# EAGLE design booster004 (EAGLE 4.16)
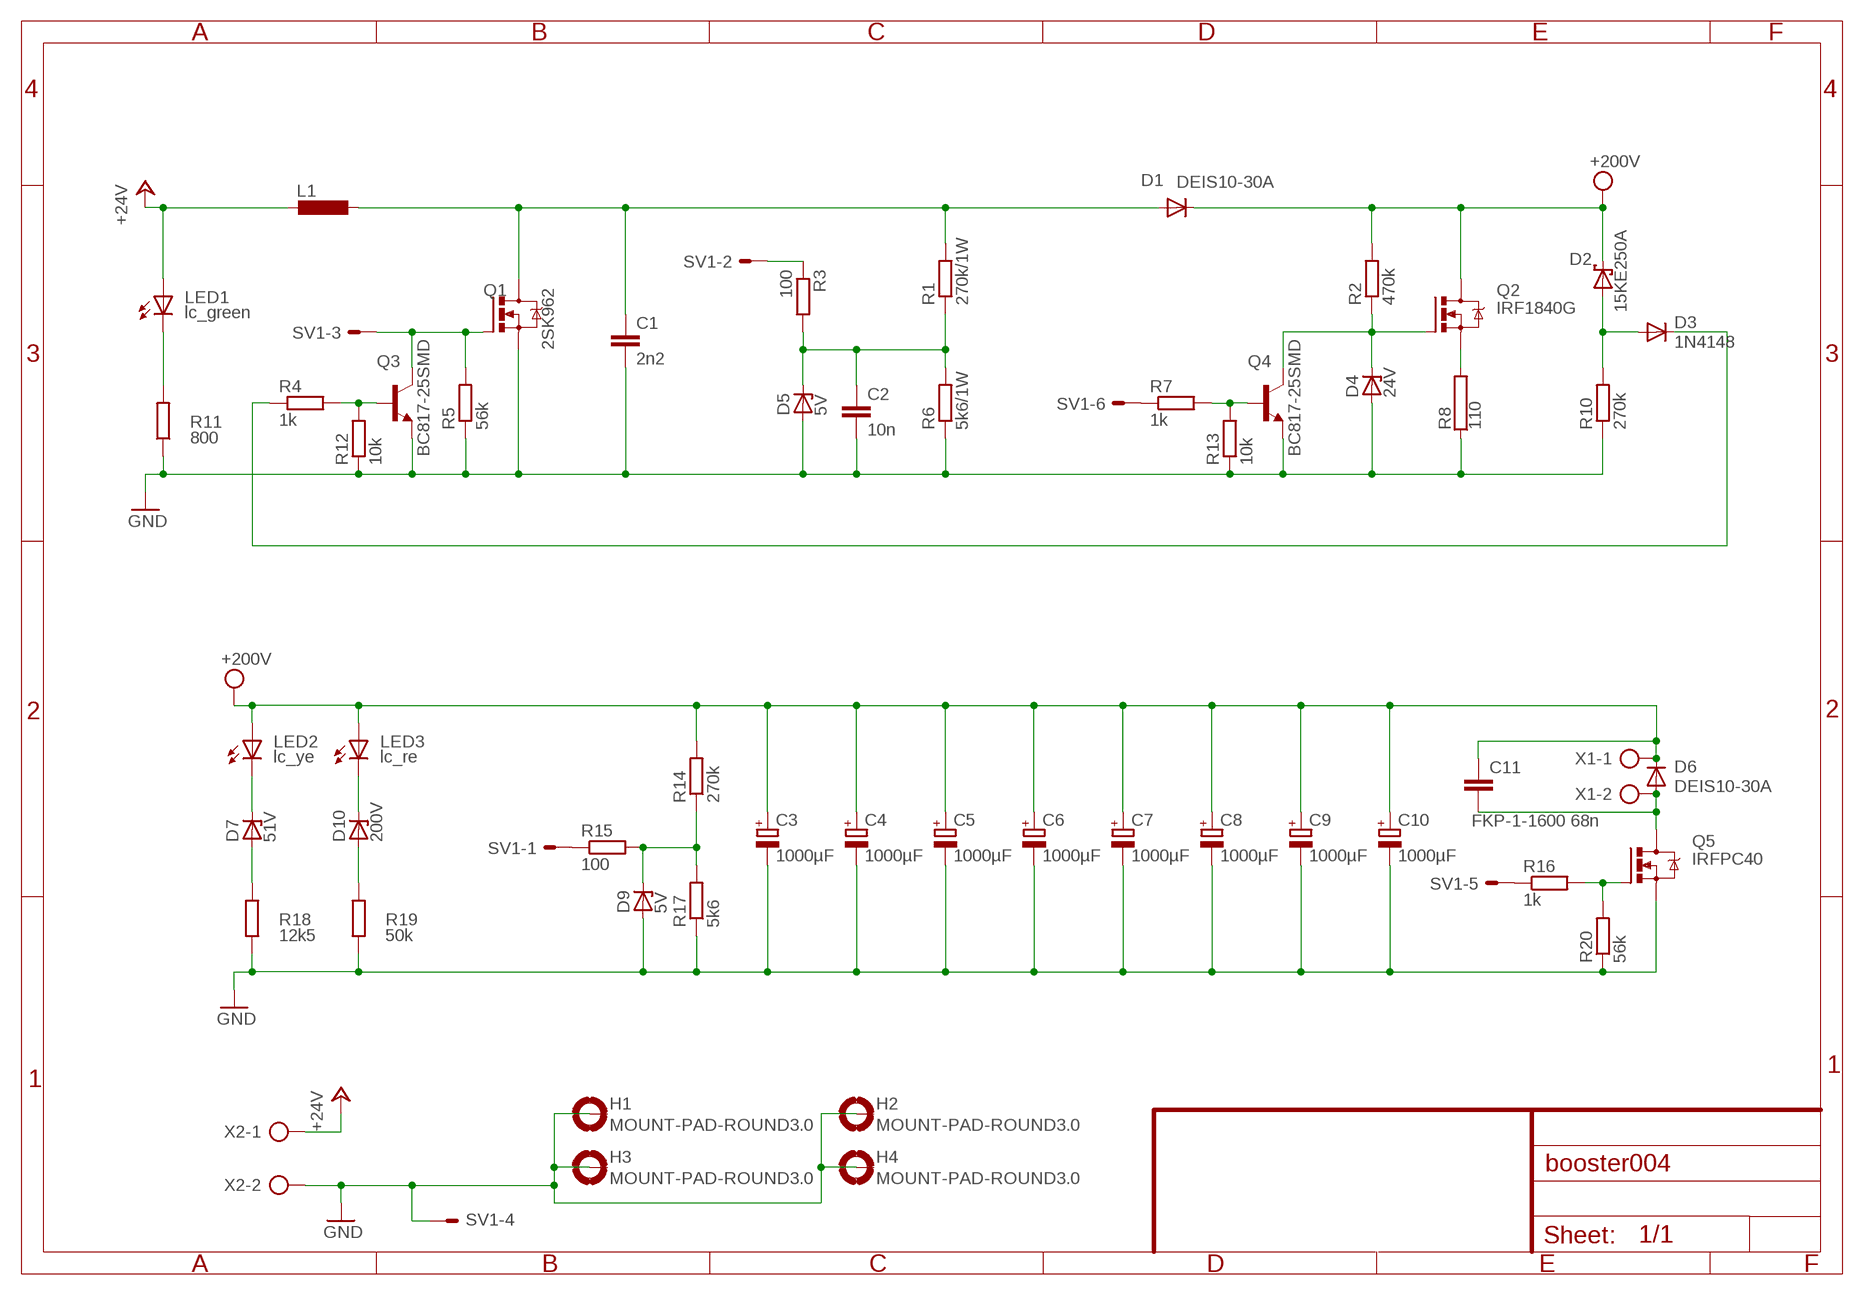
[diagram p0: schematic, sheet 1]

## Parts
C1  2n2  C-EU150-054X183  [C150-054X183]
C2  10n  C-EUC0603  [C0603]
C3  1000µF  CPOL-EUE10-35  [EB35D]
C4  1000µF  CPOL-EUE10-35  [EB35D]
C5  1000µF  CPOL-EUE10-35  [EB35D]
C6  1000µF  CPOL-EUE10-35  [EB35D]
C7  1000µF  CPOL-EUE10-35  [EB35D]
C8  1000µF  CPOL-EUE10-35  [EB35D]
C9  1000µF  CPOL-EUE10-35  [EB35D]
C10  1000µF  CPOL-EUE10-35  [EB35D]
C11  FKP-1-1600 68n  C-EU375-192X418  [C375-192X418]
D1  DEIS10-30A  [TO247AD]
D2  15KE250A  15KEXX  [CB429-17]
D3  1N4148  [DO35-10]
D4  24V  ZENER-DIODESOT23  [SOT23]
D5  5V  ZENER-DIODESOT23  [SOT23]
D6  DEIS10-30A  [TO247AD]
D7  51V  ZENER-DIODEDO35Z10  [DO35Z10]
D9  5V  ZENER-DIODESOT23  [SOT23]
D10  200V  ZENER-DIODEF126-12  [F126Z12]
H1  MOUNT-PAD-ROUND3.0  [3,0-PAD]
H2  MOUNT-PAD-ROUND3.0  [3,0-PAD]
H3  MOUNT-PAD-ROUND3.0  [3,0-PAD]
H4  MOUNT-PAD-ROUND3.0  [3,0-PAD]
L1  L-EUTJ6-U1  [TJ6-U1]
LED1  lc_green  LED5MM  [LED5MM]
LED2  lc_ye  LED5MM  [LED5MM]
LED3  lc_re  LED5MM  [LED5MM]
Q1  2SK962  IRFPC40  [TO247BV]
Q2  IRF1840G  IRF740  [TO220BV]
Q3  BC817-25SMD  [SOT23-BEC]
Q4  BC817-25SMD  [SOT23-BEC]
Q5  IRFPC40  [TO247BV]
R1  270k/1W  R-EU_0207/10  [0207/10]
R2  470k  R-EU_R0805  [R0805]
R3  100  R-EU_R0805  [R0805]
R4  1k  R-EU_R0805  [R0805]
R5  56k  R-EU_R0805  [R0805]
R6  5k6/1W  R-EU_0207/10  [0207/10]
R7  1k  R-EU_R0805  [R0805]
R8  110  RHS25  [HS25]
R10  270k  R-EU_R0805  [R0805]
R11  800  R-EU_R0805  [R0805]
R12  10k  R-EU_R0805  [R0805]
R13  10k  R-EU_R0805  [R0805]
R14  270k  R-EU_R0805  [R0805]
R15  100  R-EU_R0805  [R0805]
R16  1k  R-EU_R0805  [R0805]
R17  5k6  R-EU_R0805  [R0805]
R18  12k5  R-EU_R0805  [R0805]
R19  50k  R-EU_R0805  [R0805]
R20  56k  R-EU_R0805  [R0805]
SV1  ML6LE  [ML6L]
X1  AK500/2-H  [AK500/2-H]
X2  AK500/2-H  [AK500/2-H]

## Nets
+24V: L1.2 LED1.A X2.1
ADC_250V: C2.1 D5.3(C) R1.1 R3.2 R6.2
ADC_250V1: D9.3(C) R14.1 R15.2 R17.2
GND [Power]: C1.2 C2.2 C3.- C4.- C5.- C6.- C7.- C8.- C9.- C10.- D4.1(A) D5.1(A) D9.1(A) H1.B3,0(MOUNT) H2.B3,0(MOUNT) H3.B3,0(MOUNT) H4.B3,0(MOUNT) Q1.S Q3.E Q4.E Q5.S R5.1 R6.1 R8.1 R10.1 R11.1 R12.1 R13.1 R17.1 R18.1 R19.1 R20.1 SV1.4 X2.2
N$1: D2.A D3.A R10.2
N$2: Q5.G R16.2 R20.2
N$3: D7.A R18.2
N$4: D3.C R4.1
N$5 [Power]: C11.2 D6.A Q5.D X1.2
N$6: D7.C LED2.K(C)
N$7: LED1.K(C) R11.2
N$8: R15.1 SV1.1
N$9: R3.1 SV1.2
N$12: D10.A R19.2
N$13: D10.C LED3.K(C)
N$18: D4.3(C) Q2.G Q4.C R2.1
N$19: Q2.S R8.2
N$21: Q4.B R7.2 R13.2
N$22: R16.1 SV1.5
N$23: Q3.B R4.2 R12.2
N$24: R7.1 SV1.6
N$29: Q1.G Q3.C R5.2 SV1.3
N$32 [Power]: C1.1 D1.A L1.1 Q1.D R1.2
VPP: C3.+ C4.+ C5.+ C6.+ C7.+ C8.+ C9.+ C10.+ C11.1 D1.K(C) D2.C D6.K(C) LED2.A LED3.A Q2.D R2.2 R14.2 X1.1 ; supply symbol labelled +200V

## Library data of the parts
C1 C2 C11 = rcl:C-EU: CAPACITOR, European symbol
C3-C10 = rcl:CPOL-EU: POLARIZED CAPACITOR, European symbol
D1 D6 = carpenoctem:DEIS10-30A
D2 = diode:15KEXX: DIODE
D3 = diode:1N4148: DIODE high speed (Philips)
D4 D5 D7 D9 D10 = diode:ZENER-DIODE: Z-Diode
H1-H4 = holes:MOUNT-PAD-ROUND: MOUNTING PAD, round
L1 = rcl:L-EU: INDUCTOR, European symbol
LED1-LED3 = led:LED: LED OSRAM: - CHIPLED LG R971, LG N971, LY N971, LG Q971, LY Q971, LO R971, LY R971 LH N974, LH R974 LS Q976, LO Q976, LY Q976 LO Q996 - Hyper CHIPLED LW Q18S LB Q993, LB Q99A, LB R99A - SideLED LS A670, LO A670, LY A670, LG A670, LP A670 LB A673, LV A673, LT A673, LW A673 LH A674 LY A675 LS A676, LA A676, LO A676, LY A676, LW A676 LS A679, LY A679, LG A679 - Hyper Micro SIDELED® LS Y876, LA Y876, LO Y876, LY Y876 LT Y87S - SmartLED LW L88C, LW L88S LB L89C, LB L89S, LG L890 LS L89K, LO L89K, LY L89K LS L896, LA L896, LO L896, LY L896 - TOPLED LS T670, LO T670, LY T670, LG T670, LP T670 LSG T670, LSP T670, LSY T670, LOP T670, LYG T670 LG T671, LOG T671, LSG T671 LB T673, LV T673, LT T673, LW T673 LH T674 LS T676, LA T676, LO T676, LY T676, LB T676, LH T676, LSB T676, LW T676 LB T67C, LV T67C, LT T67C, LS T67K, LO T67K, LY T67K, LW E67C LS E67B, LA E67B, LO E67B, LY E67B, LB E67C, LV E67C, LT E67C LW T67C LS T679, LY T679, LG T679 LS T770, LO T770, LY T770, LG T770, LP T770 LB T773, LV T773, LT T773, LW T773 LH T774 LS E675, LA E675, LY E675, LS T675 LS T776, LA T776, LO T776, LY T776, LB T776 LHGB T686 LT T68C, LB T68C - Hyper Mini TOPLED® LB M676 - Mini TOPLED Santana® LG M470 LS M47K, LO M47K, LY M47K Source: http://www.osram.convergy.de - LUMILED® LXK2-PW12-R00, LXK2-PW12-S00, LXK2-PW14-U00, LXK2-PW14-V00 LXK2-PM12-R00, LXK2-PM12-S00, LXK2-PM14-U00 LXK2-PE12-Q00, LXK2-PE12-R00, LXK2-PE12-S00, LXK2-PE14-T00, LXK2-PE14-U00 LXK2-PB12-K00, LXK2-PB12-L00, LXK2-PB12-M00, LXK2-PB14-N00, LXK2-PB14-P00, LXK2-PB14-Q00 LXK2-PR12-L00, LXK2-PR12-M00, LXK2-PR14-Q00, LXK2-PR14-R00 LXK2-PD12-Q00, LXK2-PD12-R00, LXK2-PD12-S00 LXK2-PH12-R00, LXK2-PH12-S00 LXK2-PL12-P00, LXK2-PL12-Q00, LXK2-PL12-R00 Source: www.luxeon.com
Q1 Q5 = transistor-power:IRFPC40: N-CHANNEL MOS FET
Q2 = transistor-power:IRF740: N-CHANNEL MOS FET
Q3 Q4 = transistor-npn:BC817*: NPN Transistor
R1-R7 R10-R20 = rcl:R-EU_: RESISTOR, European symbol
R8 = resistor-power:R: Power Resitor
SV1 = con-harting-ml:ML6?E: HARTING
X1 X2 = con-ptr500:AK500/2-H: CONNECTOR Aug. 2004 / PTR Meßtechnik: Die Bezeichnung der Serie AK505 wurde geändert. Es handelt sich hierbei um AK500 in horizontaler Ausführung.

## Net classes
1 Power: width 0.406 mm
2 High Power: width 2 mm

## Board
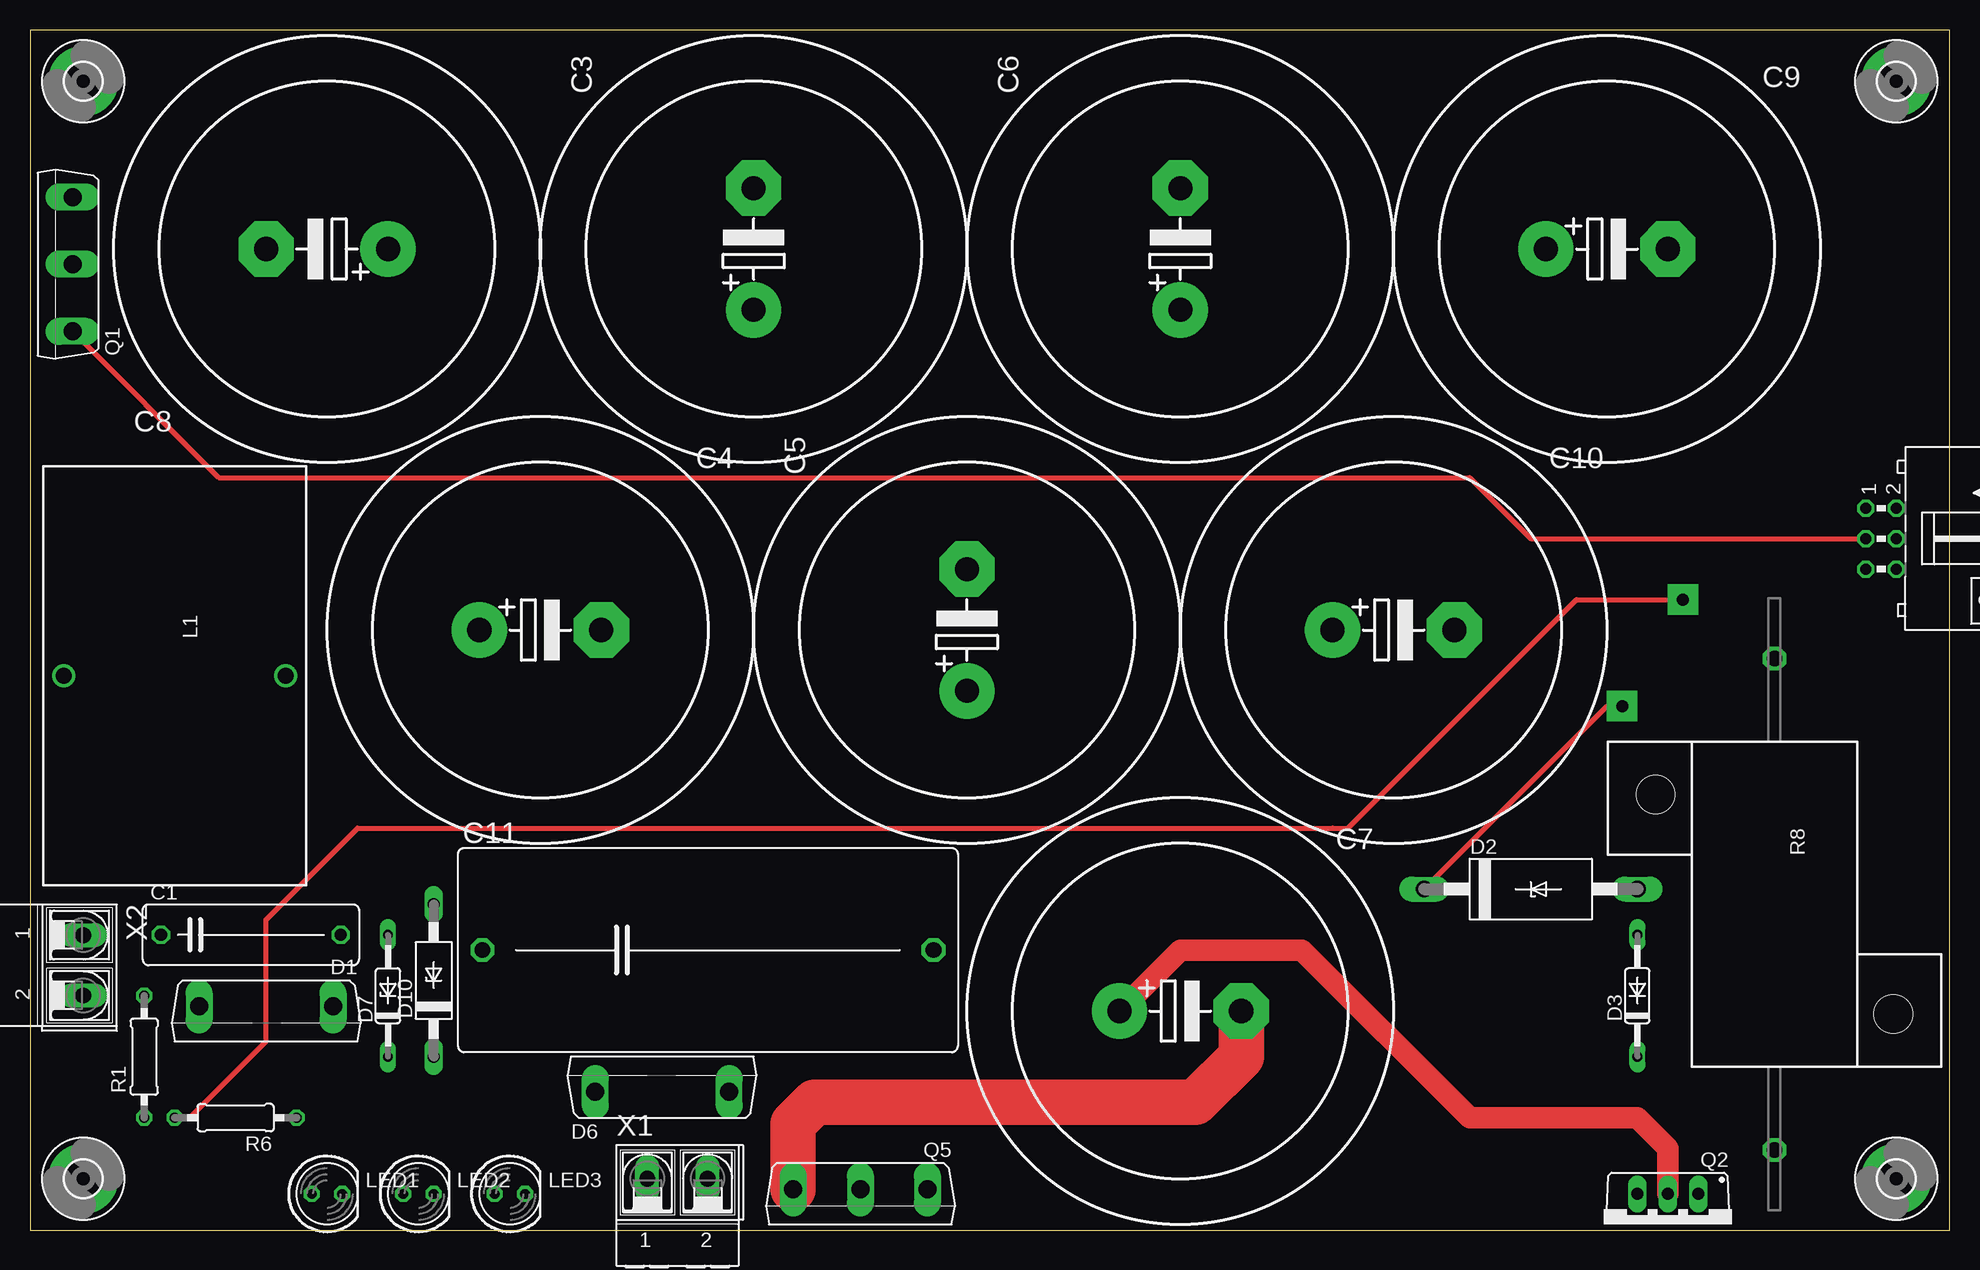
[diagram p1: board, top side]
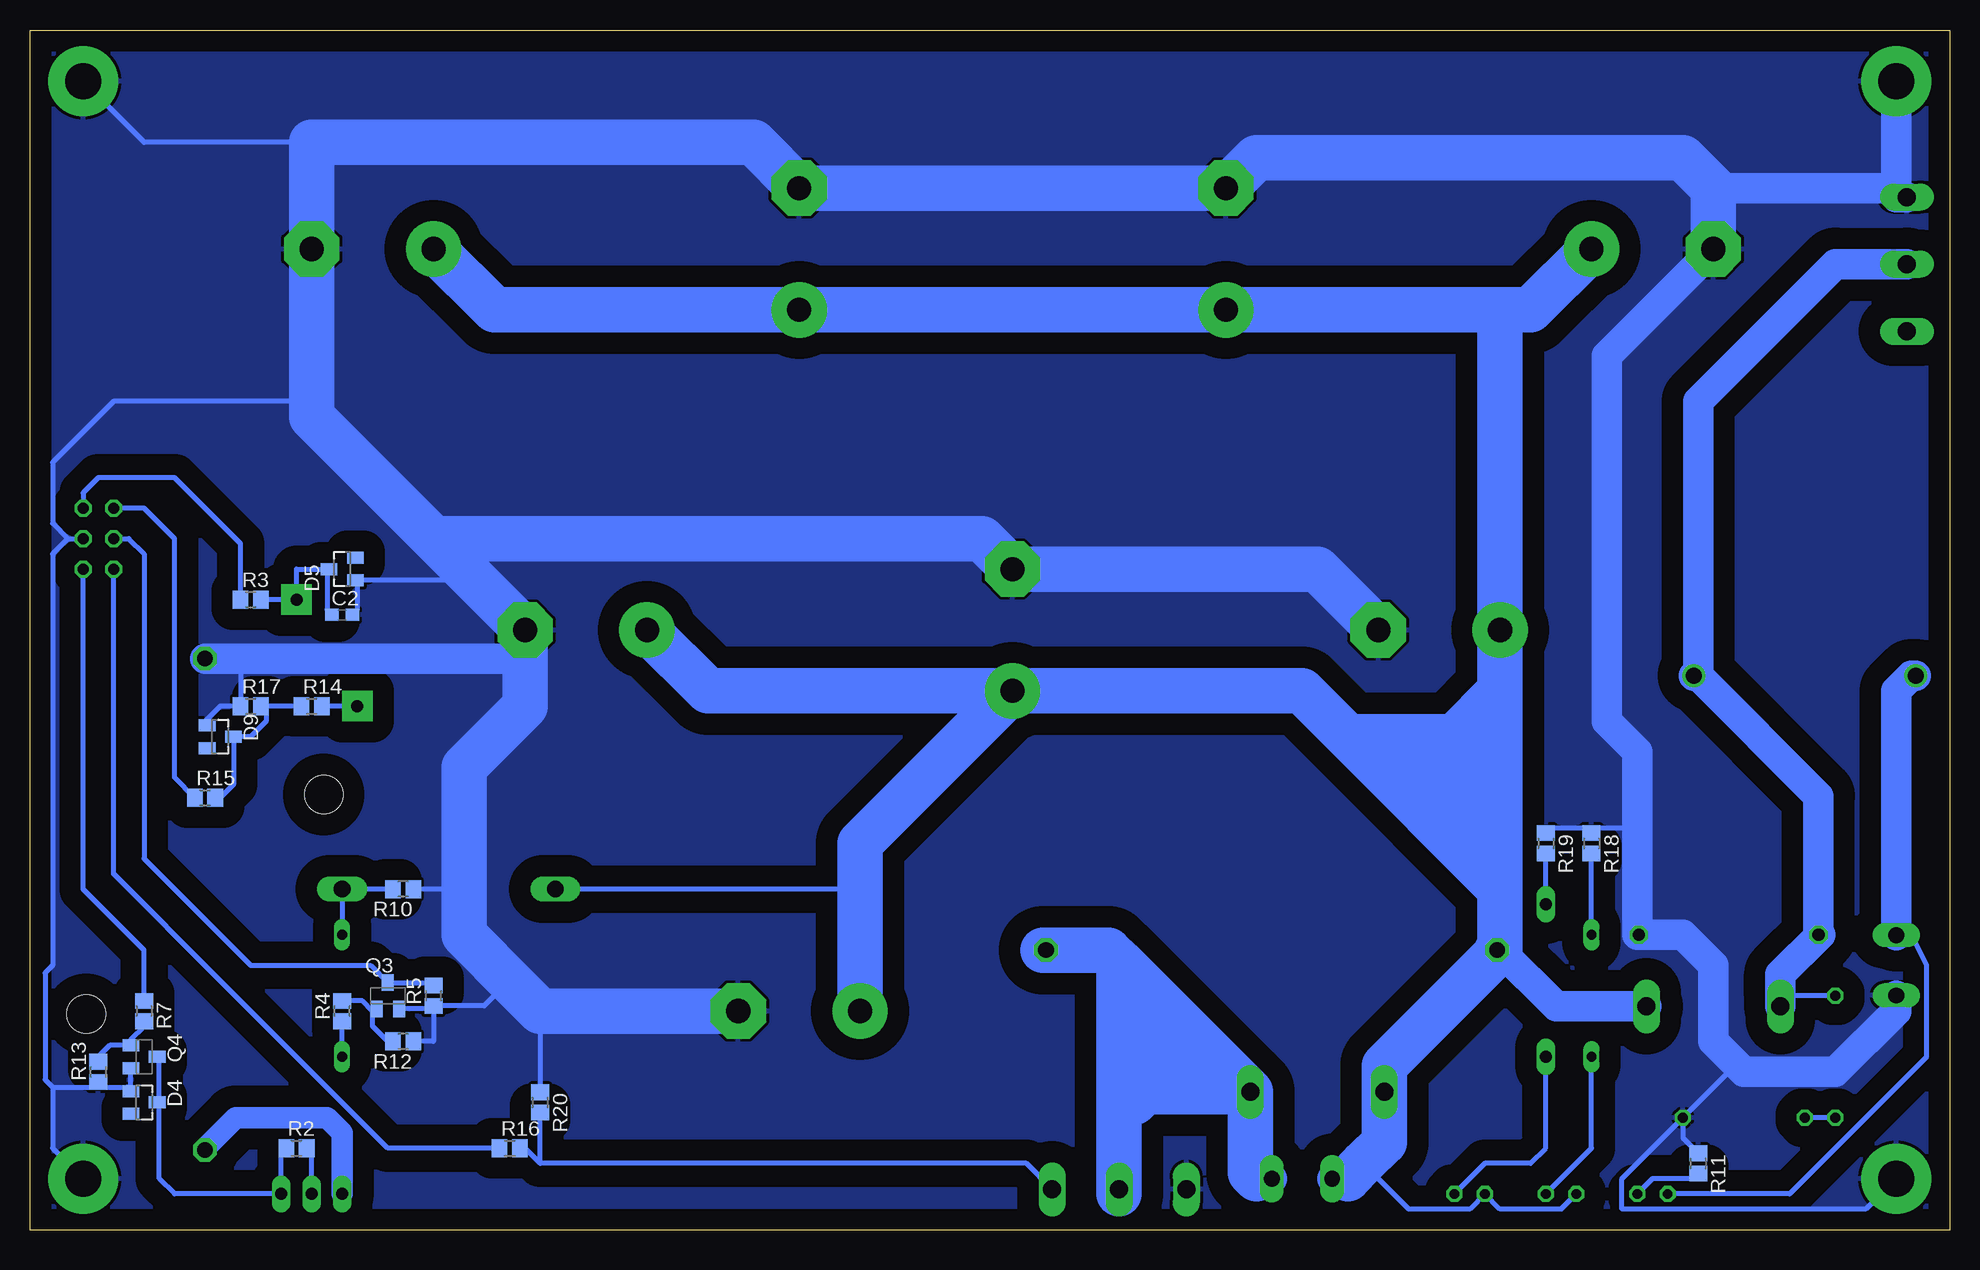
[diagram p2: board, bottom side, seen from below]

Size 160 x 100 mm. Coordinates in mm from the lower left corner, seen from the top.
Outline: 0,0 160,0 160,100 0,100 0,0
Copper layers (1*16): Top 0.035mm / dielectric 1.5mm / Bottom 0.035mm
Design rules "default": minimum track width 10mil, minimum drill 24mil, track to track 8mil, track to pad 8mil, pad to pad 8mil, via to via 8mil, smd to smd 8mil, copper to edge 40mil, drill to drill 8mil, minimum pad ring 10mil, minimum via ring 8mil, stop-mask expansion 4mil, vias tented up to drill 0mil, thermal gap 10mil

### Footprints (pad centres in the part's own frame; a part is rotated, then mirrored left to right if it is on the bottom)
C150-054X183 = drill 1.016 octagon: 1 -7.493,0; 2 7.493,0
C0603 = smd 1.1 x 1: 1 -0.85,0; 2 0.85,0
EB35D = drill 2.007 pad 4.597 round: + -5.08,0 | drill 2.007 pad 4.597 octagon: - 5.08,0
C375-192X418 = drill 1.321 octagon: 1 -18.796,0; 2 18.796,0
TO247AD = drill 1.499 long: A 5.588,-0.381; K -5.588,-0.381
CB429-17 = drill 1.397 long: A 8.89,0; C -8.89,0
DO35-10 = drill 0.813 long: A 5.08,0; C -5.08,0
SOT23 = smd 1 x 1.4: 1 -0.95,-1.1; 2 0.95,-1.1; 3 0,1.1
DO35Z10 = drill 0.813 long: A 5.08,0; C -5.08,0
F126Z12 = drill 1.016 long: A 6.35,0; C -6.35,0
3,0-PAD = drill 3 pad 5.842 round: B3,0 0,0
TJ6-U1 = drill 1.3 round: 1 -9.25,0; 2 9.25,0
LED5MM = drill 0.813 octagon: A -1.27,0; K 1.27,0
TO247BV = drill 1.499 long: D 0,-2.921; G -5.588,-2.921; S 5.588,-2.921
TO220BV = drill 1.016 long: D 0,-2.54; G -2.54,-2.54; S 2.54,-2.54
SOT23-BEC = smd 1 x 1.4: B -0.95,-1.1; C 0,1.1; E 0.95,-1.1
0207/10 = drill 0.813 octagon: 1 -5.08,0; 2 5.08,0
R0805 = smd 1.3 x 1.5: 1 -0.85,0; 2 0.85,0
HS25 = drill 1.3 octagon: 1 -20.47,0; 2 20.47,0 | hole 3.2: 9.15,9.9; -9.15,-9.9
ML6L = drill 0.914 octagon: 1 -2.54,-1.27; 2 -2.54,1.27; 3 0,-1.27; 4 0,1.27; 5 2.54,-1.27; 6 2.54,1.27
AK500/2-H = drill 1.321 long: 1 -2.515,0; 2 2.515,0

### Placement (x,y rotation side)
C1  18.41,24.6 0 top
C2  133.98,51.27 0 bottom
C3  60.32,81.75 90 top
C4  42.54,50 0 top
C5  78.1,50 90 top
C6  95.88,81.75 90 top
C7  95.88,18.25 0 top
C8  24.76,81.75 180 top
C9  131.44,81.75 0 top
C10  113.66,50 0 top
C11  56.51,23.33 0 top
D1  19.68,18.25 180 top
D2  125.09,28.41 0 top
D3  133.98,19.52 90 top
D4  150.49,10.63 270 bottom
D5  133.98,55.08 90 bottom
D6  52.7,11.9 0 top
D7  29.84,19.52 90 top
D9  144.14,41.11 270 bottom
D10  33.65,20.79 90 top
H1  4.44,95.72 0 top
H2  155.57,95.72 0 top
H3  4.44,4.28 0 top
H4  155.57,4.28 0 top
L1  12.06,46.19 180 top
LED1  24.76,3.01 0 top
LED2  32.38,3.01 0 top
LED3  40,3.01 0 top
Q1  0.63,80.48 90 top
Q2  136.52,0.47 180 top
Q3  130.17,19.52 0 bottom
Q4  150.49,14.44 270 bottom
Q5  69.21,0.47 180 top
R1  9.52,14.44 90 top
R2  137.79,6.82 0 bottom
R3  141.6,52.54 0 bottom
R4  133.98,18.25 90 bottom
R5  126.36,19.52 90 bottom
R6  17.14,9.36 180 top
R7  150.49,18.25 270 bottom
R8  145.41,27.14 270 top
R10  128.9,28.41 180 bottom
R11  20.95,5.55 270 bottom
R12  128.9,15.71 180 bottom
R13  154.3,13.17 90 bottom
R14  136.52,43.65 0 bottom
R15  145.41,36.03 0 bottom
R16  120.01,6.82 0 bottom
R17  141.6,43.65 0 bottom
R18  29.84,32.22 270 bottom
R19  33.65,32.22 270 bottom
R20  117.47,10.63 270 bottom
SV1  154.3,57.62 270 top
X1  53.97,4.28 0 top
X2  4.44,22.06 270 top

### Tracks (layer width: path | path; a pad name or v marks a point on that pad's centre or on a via)
+24V
  Bottom 0.406: X2.1 4.44,24.6 3.17,24.6 1.9,22.06 1.9,14.44 13.33,3.01 LED1.A
  Bottom 2.54: L1.2 3.17,46.19 4.44,44.92 4.44,24.6 X2.1
ADC_250V  (via drill 1 pad 2.54)
  Top 0.406: R6.2 13.33,9.36 19.68,15.71 19.68,25.87 27.3,33.49 108.58,33.49 109.85,33.49 128.9,52.54 v137.79,52.54
  Bottom 0.406: R1.1 R6.2 | C2.1 135.25,51.69 135.25,55.08 D5.3 137.79,55.08 v137.79,52.54 R3.2
ADC_250V1
  Bottom 0.406: R14.1 137.79,43.65 140.33,43.65 | 140.33,43.65 R17.2 140.33,43.65 | 140.33,43.65 140.33,42.38 141.6,41.11 D9.3 143.04,37.13 144.14,36.03 R15.2
GND
  Top 3.81: Q5.S 63.62,8.85 65.4,10.63 97.15,10.63 100.96,14.44 C7.-
  Bottom 0.406: 33.65,33.49 R19.1 33.23,33.49 29.84,33.49 R18.1 29.42,33.49 26.03,33.49 | 126.36,18.25 126.36,15.71 R12.1 | 4.44,19.52 X2.2 | 126.36,18.25 R5.1 122.13,18.67 120.01,20.79 | Q3.E 126.53,18.42 126.36,18.25 | 123.82,28.41 R10.1 | 123.19,23.96 123.82,23.33 | H3.B3,0 6.98,1.74 27.3,1.74 27.3,4.28 R6.1 | R11.1 22.22,7.67 R6.1 | R6.1 18.41,13.17 | 18.41,13.17 17.77,13.81 | 18.41,13.17 18.41,14.44 | 123.82,33.49 124.14,33.81 | 117.47,18.25 R20.1 | H2.B3,0 150.49,90.64 136.52,90.64 | C2.2 132.71,51.69 132.71,53.96 D5.1 124.77,54.13 123.82,55.08 | H4.B3,0 158.11,6.82 158.11,11.9 | Q4.E 151.59,13.34 151.76,13.17 151.59,13 D4.1 151.91,11.9 154.3,11.9 | 158.11,11.9 158.75,12.54 158.75,21.42 158.11,22.06 158.11,56.35 156.84,57.62 | 154.3,11.9 R13.1 | 158.11,11.9 154.3,11.9 | 142.87,47.61 142.87,47.46 142.45,47.04 R17.1 144.14,43.65 145.41,42.38 145.24,42.21 D9.1 | 156.84,57.62 158.11,58.89 158.11,63.97 153.03,69.05 136.52,69.05 | 156.84,57.62 SV1.4
  Bottom 2.54: 4.44,86.07 Q1.S | 4.44,86.07 H1.B3,0 | C8.- 28.57,72.86 28.57,42.38 26.03,39.84 26.03,33.49 26.03,24.6 C1.2 22.22,24.6 19.68,22.06 19.68,15.71 18.41,14.44 17.77,13.81 17.14,13.17 9.52,13.17 4.44,18.25 4.44,19.52 | 4.44,86.07 5.2,86.83 19.68,86.83 | R8.1 142.87,47.61 118.89,47.61 118.74,47.46
  Bottom 3.81: C8.- 19.68,86.83 22.22,89.37 57.78,89.37 C3.- C6.- 99.69,90.64 136.52,90.64 C9.- 136.52,69.05 136.52,67.78 126.36,57.62 | C4.- 52.7,55.08 C5.- 80.64,57.62 126.36,57.62 | 126.36,57.62 123.82,55.08 C10.- 118.74,47.46 118.74,43.65 123.82,38.57 123.82,33.49 123.82,28.41 123.82,24.6 123.19,23.96 120.01,20.79 117.47,18.25 C7.-
  pour Bottom (isolate 1.778): 160.65,0.47 160.65,100.8 -0.64,100.8 -0.64,-0.8 160.65,-0.8
N$1
  Bottom 0.406: R10.2 D2.A D3.A
N$2
  Bottom 0.406: Q5.G 76.96,5.55 117.47,5.55 | R20.2 117.47,9.36 117.47,5.55 | R16.2 118.74,6.82 117.47,5.55
N$3
  Bottom 0.406: R18.2 29.84,30.95 D7.A
N$4
  Bottom 0.406: R4.1 133.98,16.98 D3.C
N$5
  Bottom 2.54: X1.2 57.78,4.28
  Bottom 3.81: D6.A 67.05,11.52 | 67.05,11.52 67.94,10.63 | Q5.D 69.21,3.01 69.21,9.36 69.21,22.06 69.02,22.25 | C11.2 75.56,23.33 70.1,23.33 69.02,22.25 | D6.A 69.02,22.25 | D6.A 58.29,4.79 57.78,4.28 | 67.05,11.52 67.05,13.17 64.13,13.17 64.13,16.98 67.94,16.98
N$6
  Bottom 0.406: D7.C 29.84,6.82 LED2.K
N$7
  Bottom 0.406: LED1.K 24.76,4.28 22.22,4.28 20.95,4.28 R11.2
N$8
  Bottom 0.406: R15.1 147.95,37.72 147.95,57.62 150.49,60.16 SV1.1
N$9
  Bottom 0.406: R3.1 142.45,57.2 147.95,62.7 154.3,62.7 155.57,61.43 SV1.2
N$12
  Bottom 0.406: R19.2 33.65,30.95 D10.A
N$13
  Bottom 0.406: D10.C 33.65,6.82 34.92,5.55 38.73,5.55 LED3.K
N$18
  Bottom 0.406: R2.1 139.06,6.82 Q2.G 147.95,3.01 149.22,4.28 149.22,10.63 | 149.22,10.63 D4.3 149.22,10.63 | Q4.C 149.22,14.44 149.22,10.63
N$19
  Bottom 1.778: 145.41,6.82 R8.2 145.41,6.82 | Q2.S 133.98,8.09 135.25,9.36 142.87,9.36 145.41,6.82
N$21
  Bottom 0.406: R13.2 154.3,14.44 153.35,15.39 Q4.B 151.59,15.88 150.49,16.98 R7.2
N$22
  Bottom 0.406: SV1.5 153.03,29.68 144.14,20.79 130.17,6.82 R16.1
N$23
  Bottom 0.406: R12.2 130.17,15.71 131.44,16.98 131.44,18.25 | 131.44,18.25 131.27,18.42 | 131.27,18.42 Q3.B 131.27,18.42 | 131.44,18.25 131.27,18.42 | R4.2 132.29,19.1 131.44,18.25
N$24
  Bottom 0.406: R7.1 150.49,23.33 155.57,28.41 SV1.6
N$29
  Top 0.406: Q1.G 15.74,62.7 120.01,62.7 125.09,57.62 SV1.3
  Bottom 0.406: R5.2 126.36,20.79 126.53,20.62 Q3.C 131.61,22.06 141.6,22.06 150.49,30.95 150.49,56.35 151.76,57.62 SV1.3
N$32
  Bottom 0.406: 14.09,19.52 14.6,19.52 R1.2
  Bottom 2.54: Q1.D 9.52,80.48 14.6,75.4 20.95,69.05 20.95,46.19 | 20.95,46.19 L1.1 | 20.95,46.19 L1.1 | 20.95,46.19 L1.1 | 20.95,46.19 10.92,36.16 C1.1 10.79,24.6 14.09,21.3 14.09,19.52 D1.A
VPP  (via drill 1 pad 2.54)
  Top 0.406: v132.71,43.65 131.44,43.65 D2.C
  Top 1.778: Q2.D 136.52,6.82 133.98,9.36 120.01,9.36 106.04,23.33 95.88,23.33 C7.+
  Bottom 0.406: 48.89,5.55 45.08,1.74 40,1.74 LED3.A 37.46,1.74 32.38,1.74 LED2.A | 90.8,28.41 D2.C | R2.2 136.52,6.82 Q2.D | v132.71,43.65 R14.2
  Bottom 2.54: 50.16,4.28 X1.1 | 37.46,23.33 C11.1 37.46,23.33 | D1.K 32.76,18.63 37.46,23.33
  Bottom 3.81: C8.+ 34.92,76.67 37.46,76.67 | 37.46,76.67 C3.+ C6.+ 121.28,76.67 C9.+ | 37.46,76.67 C4.+ 37.46,44.92 | 37.46,44.92 41.27,41.11 50.16,41.11 | 50.16,41.11 53.97,44.92 C5.+ | C5.+ 90.8,32.22 90.8,28.41 C7.+ | C10.+ 103.5,44.92 C5.+ | 37.46,23.33 C11.1 | 37.46,23.33 47.11,13.68 D6.K 47.11,7.33 48.89,5.55 50.16,4.28 | 37.46,23.33 37.46,28.41 | 37.46,28.41 37.46,44.92 | 37.46,28.41 50.16,41.11 | 37.46,28.41 37.46,32.22 43.81,38.57 38.73,38.57